# Altium schematic sheet LeftInterface.SchDoc
size A4
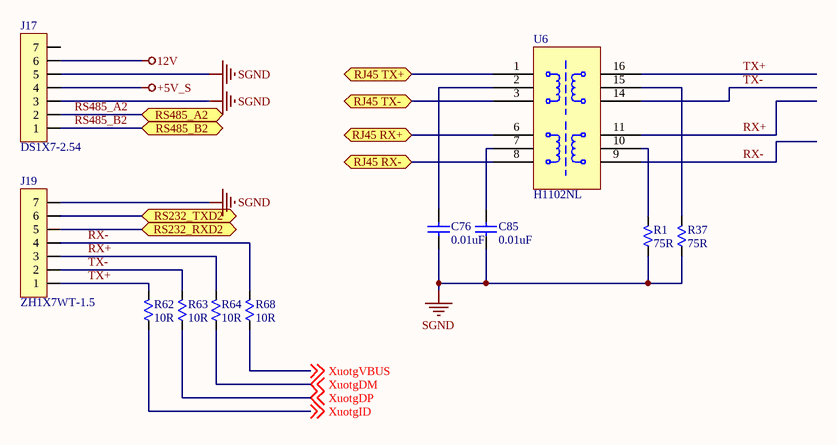
[diagram p0: LeftInterface.SchDoc]

## Parts
C76  0.01uF  [C0805]
C85  0.01uF  [C0805]
J17  DS1X7-2.54  [DS1X7H-2.54]
J19  ZH1X7WT-1.5  [ZH1X7WT-1.5]
R1  75R  [R0805]
R37  75R  [R0805]
R62  10R  [R0805]
R63  10R  [R0805]
R64  10R  [R0805]
R68  10R  [R0805]
U6  H1102NL  [SOP16]

## Ports
RJ45 RX+ (bidir), RJ45 RX- (bidir), RJ45 TX+ (bidir), RJ45 TX- (bidir), RS232_RXD2 (bidir), RS232_TXD2 (bidir), RS485_A2 (bidir), RS485_B2 (bidir)

## Nets
12V: J17.6
+5V_S: J17.4
SGND: C76.2 C85.2 J17.3 J17.5 J19.7 R1.2 R37.2
RJ45 RX+: U6.6 ; port RJ45 RX+
RJ45 RX-: U6.8 ; port RJ45 RX-
RJ45 TX+: U6.1 ; port RJ45 TX+
RJ45 TX-: U6.3 ; port RJ45 TX-
RS232_RXD2: J19.5 ; port RS232_RXD2
RS232_TXD2: J19.6 ; port RS232_TXD2
RS485_A2: J17.2 ; port RS485_A2
RS485_B2: J17.1 ; port RS485_B2
RX+: J19.3 R64.1 U6.11
RX-: J19.4 R68.1 U6.9
TX+: J19.1 R62.1 U6.16
TX-: J19.2 R63.1 U6.14
XuotgDM: R64.2 ; off-sheet XuotgDM
XuotgDP: R63.2 ; off-sheet XuotgDP
XuotgID: R62.2 ; off-sheet XuotgID
XuotgVBUS: R68.2 ; off-sheet XuotgVBUS
NetC76_1: C76.1 U6.2
NetC85_1: C85.1 U6.7
NetR1_1: R1.1 U6.10
NetR37_1: R37.1 U6.15

Not connected (* = marked no-connect by the designer): J17 7

## Library data of the parts
C76 C85 = Cap: Capacitor; Value: 22pF; Published: 8-Jun-2000; Revision: July-2002: Re-released for DXP Platform.; Publisher: Altium Limited
J17 J19 = HEADER1X7
R1 R37 R62-R64 R68 = Res: Resistor; Published: 8-Jun-2000; LatestRevisionDate: 04-Mar-2005; LatestRevisionNote: PCB Footprint replaced.; PackageReference: J1-0603; Publisher: Altium Limited
  R1 R37: Value: 75R
  R62-R64 R68: Value: 10R